# EAGLE design RFM69HCW_BOB (EAGLE 6.5.0)
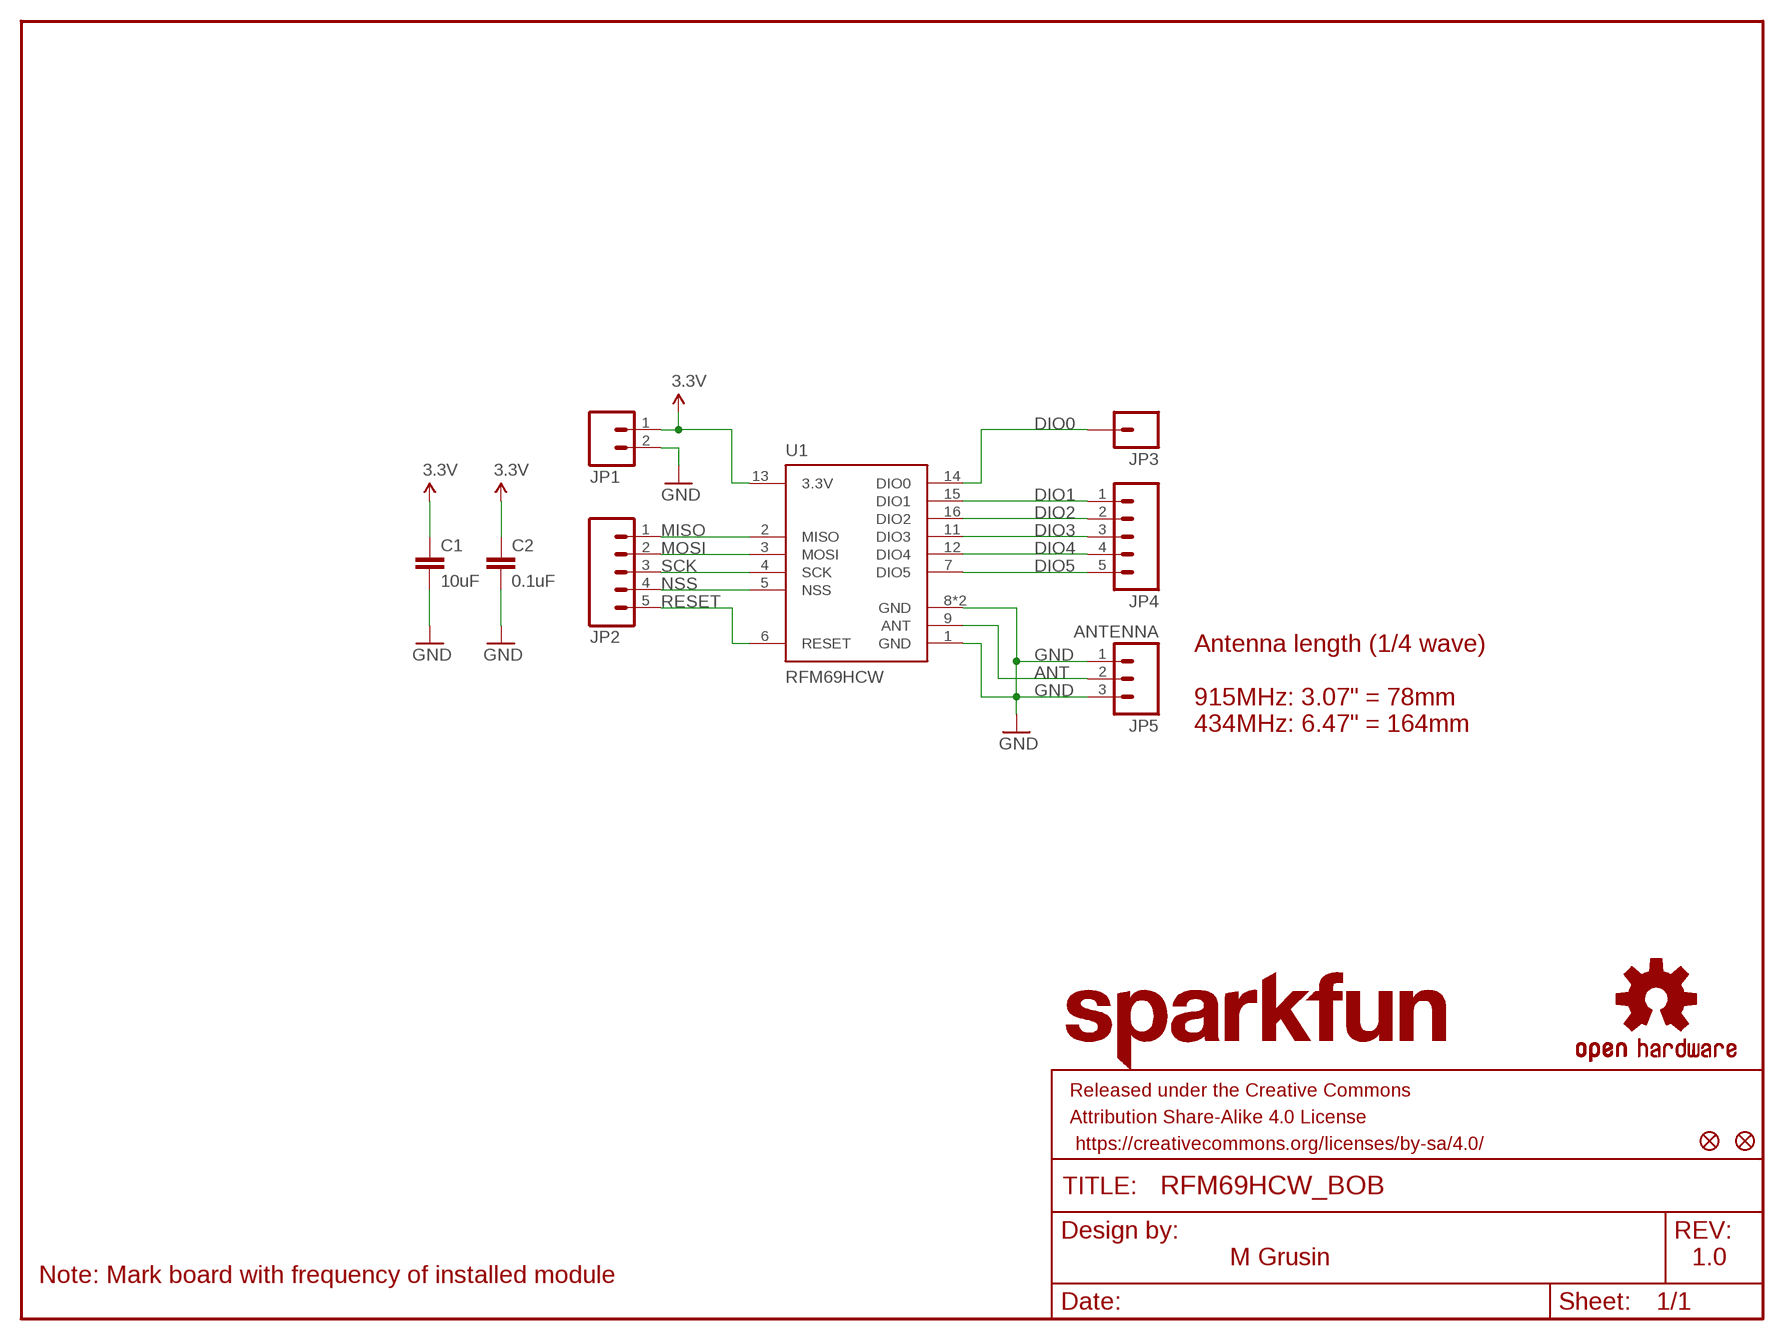
[diagram p0: schematic, sheet 1]

## Parts
C1  10uF  10UF50V20%(1210)  [1210]
C2  0.1uF  0.1UF-25V(+80/-20%)(0603)  [0603-CAP]
FID1  FIDUCIAL1X2  [FIDUCIAL-1X2]
FID2  FIDUCIAL1X2  [FIDUCIAL-1X2]
FRAME1  FRAME-LETTER  [CREATIVE_COMMONS]
JP1  M021X02_NO_SILK  [1X02_NO_SILK]
JP2  M05_ROUNDONLY_NOSILK  [1X05_ROUNDONLY_NOSILK]
JP3  M01SMDNS  [1X01NS]
JP4  M05_ROUNDONLY_NOSILK  [1X05_ROUNDONLY_NOSILK]
JP5  ANTENNA  M03_ROUND_ONLY_NO_SILK  [1X03_ROUND_ONLY_NO_SILK]
LOGO1  SFE_LOGO_NAME.1_INCH  [SFE_LOGO_NAME_.1]
LOGO2  OSHW-LOGOS  [OSHW-LOGO-S]
U1  RFM69HCW  [RFM69HCW-XXXS2]

## Nets
3.3V: C1.1 C2.1 JP1.1 U1.13(3.3V)
ANT: JP5.2 U1.9(ANT)
DIO0: JP3.1 U1.14(DIO0)
DIO1: JP4.1 U1.15(DIO1)
DIO2: JP4.2 U1.16(DIO2)
DIO3: JP4.3 U1.11(DIO3)
DIO4: JP4.4 U1.12(DIO4)
DIO5: JP4.5 U1.7(DIO5)
GND: C1.2 C2.2 JP1.2 JP5.1 JP5.3 U1.1(GND) U1.8(GND) U1.10(GND)
MISO: JP2.1 U1.2(MISO)
MOSI: JP2.2 U1.3(MOSI)
NSS: JP2.4 U1.5(NSS)
RESET: JP2.5 U1.6(RESET)
SCK: JP2.3 U1.4(SCK)

## Notes on the sheet
- Antenna length (1/4 wave)
  
  915MHz: 3.07" = 78mm
  434MHz: 6.47" = 164mm
- M Grusin | 1.0
- Note: Mark board with frequency of installed module

## Library data of the parts
C1 = SparkFun-Capacitors:10UF50V20%(1210): CAP-09824; PROD_ID: CAP-09824
C2 = SparkFun-Capacitors:0.1UF-25V(+80/-20%)(0603): CAP-00810 Ceramic Standard decoupling cap; PROD_ID: CAP-00810
FID1 FID2 = SparkFun-Aesthetics:FIDUCIAL: Fiducial Alignment Points Various fiducial points for machine vision alignment.
FRAME1 = SparkFun-Aesthetics:FRAME-LETTER: Schematic Frame Standard 8.5x11 US Letter frame
JP1 = mike-temp:M02: Header 2 Standard 2-pin 0.1" header. Use with straight break away headers (SKU : PRT-00116), right angle break away headers (PRT-00553), swiss pins (PRT-00743), machine pins (PRT-00117), and female headers (PRT-00115). Molex polarized connector foot print use with SKU : PRT-08233 with associated crimp pins and housings.
JP2 JP4 = mike-temp:M05: Header 5 Standard 5-pin 0.1" header. Use with straight break away headers (SKU : PRT-00116), right angle break away headers (PRT-00553), swiss pins (PRT-00743), machine pins (PRT-00117), and female headers (PRT-00115). Molex polarized connector foot print use with SKU : PRT-08230 with associated crimp pins and housings.
JP3 = mike-temp:M01: Header 1 Standard 1-pin 0.1" header. Use with straight break away headers (SKU : PRT-00116), right angle break away headers (PRT-00553), swiss pins (PRT-00743), machine pins (PRT-00117), and female headers (PRT-00115).
JP5 = mike-temp:M03: Header 3 Standard 3-pin 0.1" header. Use with straight break away headers (SKU : PRT-00116), right angle break away headers (PRT-00553), swiss pins (PRT-00743), machine pins (PRT-00117), and female headers (PRT-00115). Molex polarized connector foot print use with SKU : PRT-08232 with associated crimp pins and housings.
LOGO1 = SparkFun-Aesthetics:SFE_LOGO_NAME: SFE Logo, name only This is the SparkFun name logo. The logo on the schematic will always be the same size; the package variant is the height of the flame part of the logo (or the height the flame would be, if it were drawn). Default layer for the logo on the board is tSilk.
LOGO2 = SparkFun-Aesthetics:OSHW-LOGO: Open Source Hardware Logo This logo indicates the piece of hardware it is found on incorporates a OSHW license and/or adheres to the definition of open source hardware found here: http://freedomdefined.org/OSHW
U1 = mike-temp:RFM69H

## Board
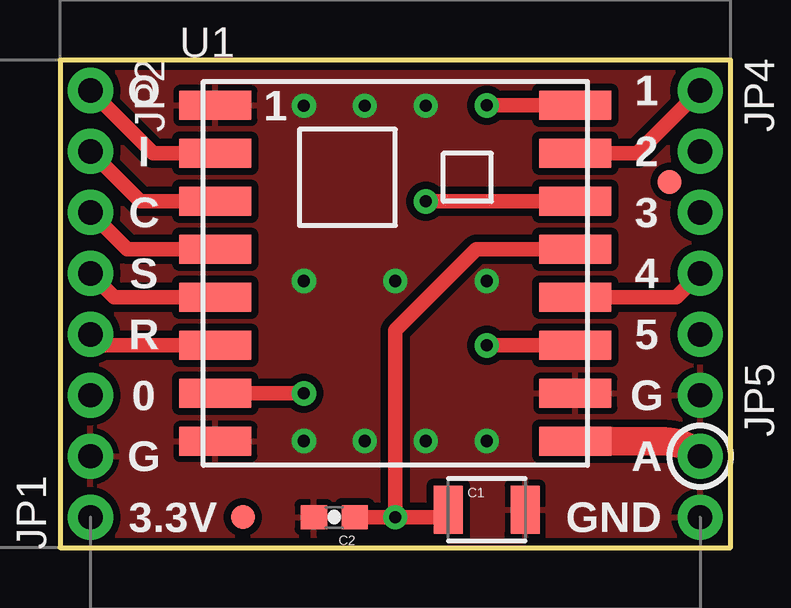
[diagram p1: board, top side]
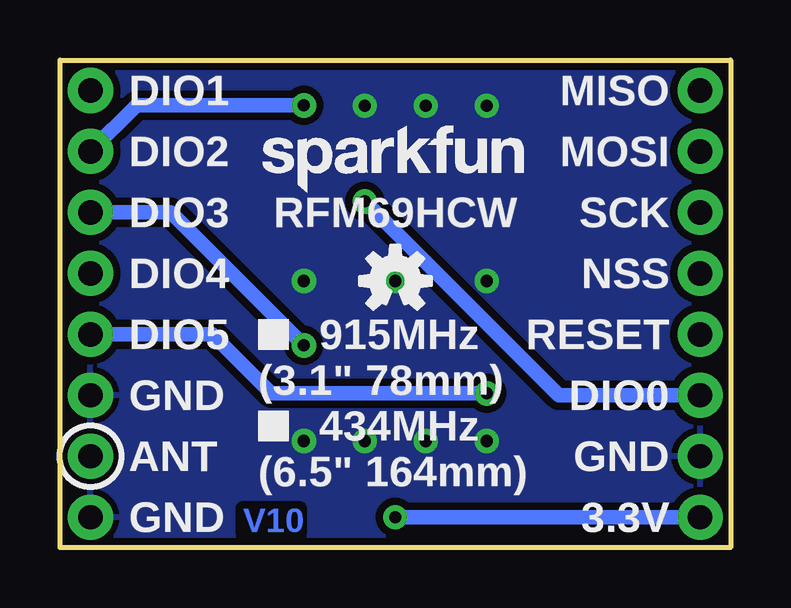
[diagram p2: board, bottom side, seen from below]

Size 27.94 x 20.32 mm. Coordinates in mm from the lower left corner, seen from the top.
Outline: 0,0 27.94,0 27.94,20.32 0,20.32 0,0
Copper layers (1*16): Top 0.035mm / dielectric 1.5mm / Bottom 0.035mm
Design rules "SparkFun": minimum track width 7mil, minimum drill 15mil, track to track 8mil, track to pad 8mil, pad to pad 8mil, via to via 8mil, smd to smd 8mil, copper to edge 8mil, drill to drill 8mil, minimum pad ring 12mil, minimum via ring 10mil, stop-mask expansion 4mil, vias tented up to drill 20mil, thermal gap 10mil

### Footprints (pad centres in the part's own frame; a part is rotated, then mirrored left to right if it is on the bottom)
1210 = smd 1.2 x 2: 1 -1.6,0; 2 1.6,0
0603-CAP = smd 1.1 x 1: 1 -0.85,0; 2 0.85,0
FIDUCIAL-1X2 = smd 1 x 1: 1 0,0
1X02_NO_SILK = drill 1.016 pad 1.88: 1 0,0; 2 2.54,0
1X05_ROUNDONLY_NOSILK = drill 1.016 pad 1.88: 1 0,0; 2 2.54,0; 3 5.08,0; 4 7.62,0; 5 10.16,0
1X01NS = drill 1.016 pad 1.88: 1 0,0
1X03_ROUND_ONLY_NO_SILK = drill 1.016 pad 1.88: 1 0,0; 2 2.54,0; 3 5.08,0
RFM69HCW-XXXS2 = smd 3 x 1.2: 1 -7.5,7; 2 -7.5,5; 3 -7.5,3; 4 -7.5,1; 5 -7.5,-1; 6 -7.5,-3; 7 -7.5,-5; 8 -7.5,-7; 9 7.5,-7; 10 7.5,-5; 11 7.5,-3; 12 7.5,-1; 13 7.5,1; 14 7.5,3; 15 7.5,5; 16 7.5,7

### Placement (x,y rotation side)
C1  17.78,1.59 0 top
C2  11.43,1.27 180 top
FID1  7.62,1.27 0 top
FID2  25.4,15.24 0 top
FRAME1  -15.24,-12.7 0 top  (outside the outline)
JP1  1.27,1.27 90 top
JP2  1.27,19.05 270 top
JP3  1.27,6.35 0 top
JP4  26.67,19.05 270 top
JP5  26.67,6.35 270 top
LOGO1  20,14.29 0 bottom
LOGO2  13.97,11.11 0 bottom
U1  13.97,11.43 0 top

### Tracks (layer width: path | path; a pad name or v marks a point on that pad's centre or on a via)
3.3V  (via drill 0.51)
  Top 0.61: v13.97,1.27 13.97,9.06 17.34,12.43 U1.13 | v13.97,1.27 C2.1 | v13.97,1.27 16.18,1.27 C1.1
  Bottom 0.61: JP1.1 v13.97,1.27
ANT
  Top 1.194: U1.9 25.17,4.43 arc-45 JP5.2
DIO0  (via drill 0.51)
  Top 0.61: U1.14 v15.24,14.43
  Bottom 0.61: v15.24,14.43 7.16,6.35 JP3.1
DIO1
  Top 0.61: U1.15 24.05,16.43 JP4.1
DIO2  (via drill 0.51)
  Top 0.61: U1.16 v17.78,18.43
  Bottom 0.61: JP4.2 24.75,18.43 v17.78,18.43
DIO3  (via drill 0.51)
  Top 0.61: U1.11 v17.78,8.43
  Bottom 0.61: JP4.3 23.32,13.97 v17.78,8.43
DIO4
  Top 0.61: U1.12 25.67,10.43 JP4.4
DIO5  (via drill 0.51)
  Top 0.61: U1.7 v10.16,6.43
  Bottom 0.61: JP4.5 21.59,8.89 19.13,6.43 v10.16,6.43
GND  (via drill 0.51)
  other vias: 17.78,4.45 10.16,4.45 12.7,4.45 15.24,4.45 12.7,18.41 15.24,18.41 10.16,18.41 10.16,11.11 13.97,11.11 17.78,11.11
  pour Bottom (isolate 0.305): 0,20.32 27.94,20.32 27.94,0 0,0
  pour Top (isolate 0.305): 0,20.32 27.94,20.32 27.94,0 0,0
MISO
  Top 0.61: U1.2 3.89,16.43 JP2.1
MOSI
  Top 0.61: U1.3 3.35,14.43 JP2.2
NSS
  Top 0.61: U1.5 2.27,10.43 JP2.4
RESET
  Top 0.61: U1.6 1.73,8.43 JP2.5
SCK
  Top 0.61: U1.4 2.81,12.43 JP2.3

### Text on the board
Bottom: V10
tPlace: O | 1 | I | 2 | C | 3 | S | 4 | R | 5 | 0 | G | G | A | 3.3V | GND
bPlace: MISO | DIO1 | MOSI | DIO2 | SCK | RFM69HCW | DIO3 | NSS | DIO4 | RESET | 915MHz | DIO5 | DIO0 | (3.1" 78mm) | GND | 434MHz | GND | (6.5" 164mm) | ANT | 3.3V | GND
tDocu: M Grusin